# Altium schematic sheet CloudCover.SchDoc: Washing Hand Wrist Device
size A3; DrawnBy: Erwin Noble; Organization: Kickr Design; Address1: 1710 Chattahoochee Ave NW; Address2: Atlanta; Address3: GA; Address4: 30318; Revision: A; SheetNumber: 1; SheetTotal: 1
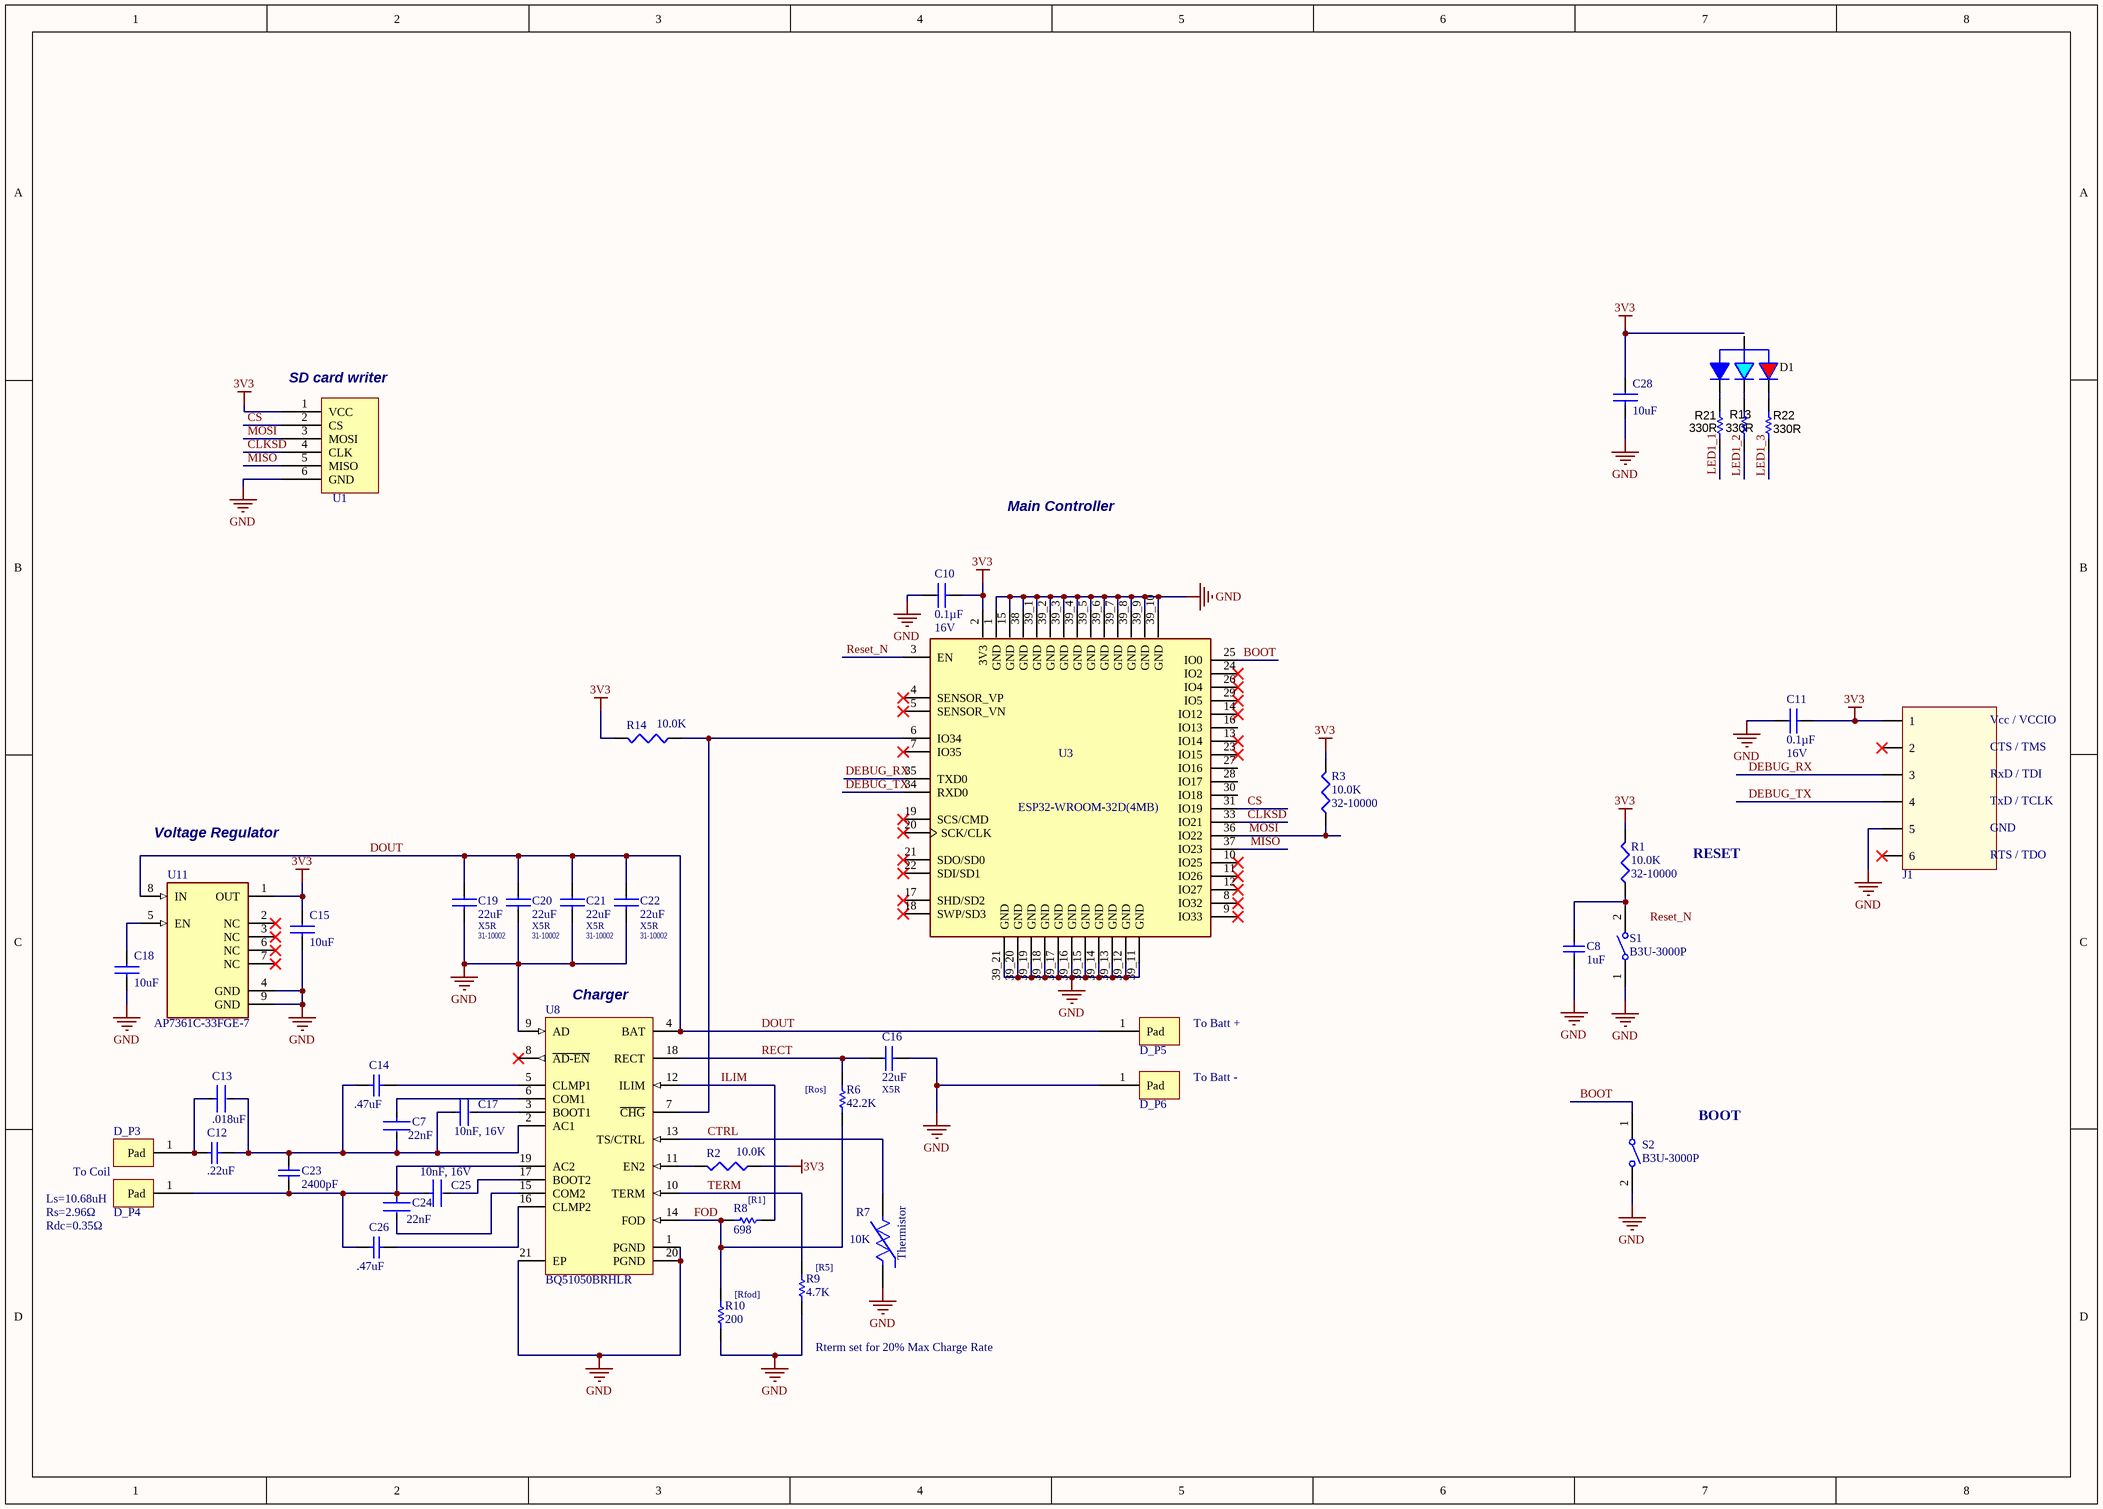
[diagram p0: CloudCover.SchDoc]

## Parts
C7  22nF  [FP-CC0402-MFG]
C8  1uF  [CAPC1005X55X25LL05T10]
C10  Capacitance: 0.1µF  Voltage - Rated: 16V  [SMC_IPC_0402]  (hidden comment: Cap, 0.1uF, 16V, X7R, 0402)
C11  Capacitance: 0.1µF  Voltage - Rated: 16V  [SMC_IPC_0402]  (hidden comment: Cap, 0.1uF, 16V, X7R, 0402)
C12  .22uF  [CAPC2013X145X50ML20T25]
C13  .018uF  [FP-C0603C-CF-MFG]
C14  .47uF  [CAPC1005X55X25LL05T10]
C15  10uF  [SMC_0603]
C16  22uF  Dielectric: X5R  [SMC_0805]
C17  10nF, 16V  [FP-CC0402-MFG]
C18  10uF  [SMC_0603]
C19  22uF  Dielectric: X5R  [SMC_0805]
C20  22uF  Dielectric: X5R  [SMC_0805]
C21  22uF  Dielectric: X5R  [SMC_0805]
C22  22uF  Dielectric: X5R  [SMC_0805]
C23  2400pF  [CAPC1608X90X35NL10T15]
C24  22nF  [FP-CC0402-MFG]
C25  10nF, 16V  [FP-CC0402-MFG]
C26  .47uF  [CAPC1005X55X25LL05T10]
C28  10uF  [SMC_0603]
D1  CLMVC-FKC-CGJJM569ABB7A343  [CLMVC-FKC-CGJJM569ABB7A343]  (value not drawn)
D_P3  PAD  [PAD 2x1.5]  (value not drawn)
D_P4  PAD  [PAD 2x1.5]  (value not drawn)
D_P5  PAD  [PAD 2x1.5]  (value not drawn)
D_P6  PAD  [PAD 2x1.5]  (value not drawn)
J1  TC2030-NL-FTDI TTL-232R USB  [TC2030-MCP - NL]  (value not drawn)  (no BOM)
R1  10.0K  [SMR_0402 - Basil]
R2  10.0K  [SMR_0402 - Basil]
R3  10.0K  [SMR_0402 - Basil]
R6  42.2K  [RESC1005X40X25NL05T10]
R7  10K  [FP-NTCS0805-MFG]
R8  698  [RESC1005X40X25ML05T05]
R9  4.7K  [RESC1005X40X25LL05T05]
R10  200  [RESC1005X40X25ML05T10]
R13  330R  [0402]
R14  10.0K  [SMR_0402 - Basil]
R21  330R  [0402]
R22  330R  [0402]
S1  B3U-3000P  [OMRON-B3U-3000P_V]
S2  B3U-3000P  [OMRON-B3U-3000P_V]
U1  SDCARDSLOT  (value not drawn)
U3  ESP32-WROOM-32D(4MB)  [MODULE_ESP32-WROOM-32D]
U8  BQ51050BRHLR  [RHL0020A_V]
U11  AP7361C-33FGE-7  [FP-U-DFN3030-8_Type_E-MFG]

## Nets
3V3: C10.2 C11.2 C15.1 C28.1 J1.1 R1.2 R2.1 R3.2 R14.2 U1.1(VCC) U3.2(3V3) U11.1(OUT)
GND: C8.1 C10.1 C11.1 C15.2 C16.2 C18.2 C19.2 C20.2 C21.2 C22.2 C28.2 D_P6.1(Pad) J1.5 R7.1 R9.1 R10.1 S1.1 S2.2 U1.6(GND) U3.1(GND) U3.15(GND) U3.38(GND) U3.39_1(GND) U3.39_2(GND) U3.39_3(GND) U3.39_4(GND) U3.39_5(GND) U3.39_6(GND) U3.39_7(GND) U3.39_8(GND) U3.39_9(GND) U3.39_10(GND) U3.39_11(GND) U3.39_12(GND) U3.39_13(GND) U3.39_14(GND) U3.39_15(GND) U3.39_16(GND) U3.39_17(GND) U3.39_18(GND) U3.39_19(GND) U3.39_20(GND) U3.39_21(GND) U8.1(PGND) U8.9(AD) U8.20(PGND) U8.21(EP) U11.4(GND) U11.9(GND)
BOOT: S2.1 U3.25(IO0)
CLKSD: U1.4(CLK) U3.33(IO21)
CS: U1.2(CS) U3.31(IO19)
CTRL: R7.2 U8.13(TS/CTRL)
DEBUG_RX: J1.3 U3.35(TXD0)
DEBUG_TX: J1.4 U3.34(RXD0)
DOUT: C19.1 C20.1 C21.1 C22.1 D_P5.1(Pad) U8.4(BAT) U11.8(IN)
FOD: R6.1 R8.1 R10.2 U8.14(FOD)
ILIM: R8.2 U8.12(ILIM)
LED1_1: R21.1
LED1_2: R13.1
LED1_3: R22.1
MISO: U1.5(MISO) U3.37(IO23)
MOSI: R3.1 U1.3(MOSI) U3.36(IO22)
RECT: C16.1 R6.2 U8.18(RECT)
Reset_N: U3.3(EN)
TERM: R9.2 U8.10(TERM)
NetC7_1: C7.1 U8.6(COM1)
NetC7_2: C7.2 C12.2 C13.2 C14.1 C17.1 C23.2 U8.2(AC1)
NetC8_2: C8.2 R1.1 S1.2
NetC12_1: C12.1 C13.1 D_P3.1(Pad)
NetC14_2: C14.2 U8.5(CLMP1)
NetC17_2: C17.2 U8.3(BOOT1)
NetC18_1: C18.1 U11.5(EN)
NetC23_1: C23.1 C24.1 C25.1 C26.1 D_P4.1(Pad) U8.19(AC2)
NetC24_2: C24.2 U8.15(COM2)
NetC25_2: C25.2 U8.17(BOOT2)
NetC26_2: C26.2 U8.16(CLMP2)
NetD1_2: D1.2(K) R21.2
NetD1_3: D1.3(K) R13.2
NetD1_4: D1.4(K) R22.2
NetR2_2: R2.2 U8.11(EN2)
NetR14_1: R14.1 U3.6(IO34) U8.7(~{CHG})

Not connected (* = marked no-connect by the designer): D1 1(A); J1 2* 6*; U3 4(SENSOR_VP)* 5(SENSOR_VN)* 7(IO35)* 8(IO32)* 9(IO33)* 10(IO25)* 11(IO26)* 12(IO27)* 13(IO14)* 14(IO12)* 16(IO13) 17(SHD/SD2)* 18(SWP/SD3)* 19(SCS/CMD)* 20(SCK/CLK)* 21(SDO/SD0)* 22(SDI/SD1)* 23(IO15)* 24(IO2)* 26(IO4)* 27(IO16) 28(IO17) 29(IO5)* 30(IO18); U8 8(~{AD-EN})*; U11 2(NC)* 3(NC)* 6(NC)* 7(NC)*

## Notes on the sheet
- (near U1) SD card writer
- Main Controller
- Voltage Regulator
- RESET
- (near U8) Charger
- To Batt +
- (near R6) [Ros]
- To Batt -
- BOOT
- To Coil
- Ls=10.68uH
- Rs=2.96Ω
- Rdc=0.35Ω
- (near R8) [R1]
- (near R7) Thermistor
- (near R10) [Rfod]
- (near R9) [R5]
- (near R9) Rterm set for 20% Max Charge Rate
- Labels drawn without touching a wire or pin: Reset_N
- Title
- Size:
- Date:
- A3
- Number:
- Time:
- Revision:
- Sheet
- of
- File:
- (in symbol TC2030-NL) Vcc / VCCIO; CTS / TMS; RxD / TDI; TxD / TCLK; GND; RTS / TDO

## Library data of the parts
C7 C24 = CMP-03422-000454-1: CC0402KPX7R7BB223 CC0402 22 nF X7R 10.00% 16 V; Manufacturer: YAGEO; Voltage Rating: 16 V; Automotive Grade: NA; Material: Ceramic; Tolerance: 0.1; Temperature Coefficient: 30ppm/°C; Automotive: No; Temperature Range Low: -55°C; Device Class L1: Passive Components; Height: 0.55mm; Temperature: -55°C to +125°C; Category: Cap; Capacitance: 22 nF; Device Class L3: Ceramic Capacitors; Lead Free: Yes; Ipc Land Pattern Name: CAPC10050X50; Package: CC0402; Device Class L2: Capacitors; Octopart: https://octopart.com/cc0402kpx7r7bb223-yageo-39266182; Temperature Characteristic: X7R; Footprint Url: http://www.yageo.com/exep/pages/download/literatures/UPY-C_GEN_24.pdf; Manufacturer Part Number: CC0402KPX7R7BB223; ComponentLink2Description: Datasheet; RoHS: TRUE; Value: 22 nF; Mouser Description: Multilayer Ceramic Capacitors MLCC - SMD/SMT 22nF 16V X7R 10%; ComponentLink2URL: http://www.yageo.com/documents/recent/UPY-GP_NP0_16V-to-50V_16.pdf; Temperature Range High: +125°C
C8 = CMP-2008-04506-1: GRM155C80J105KE15D; Manufacturer: Murata; Part Number: GRM155C80J105KE15D
C10 C11 = 31-10107: Capacitor, Ceramic, 0402, X7R, 16V, 0.1uF; Manufacturer: Murata Electronics North America; Manufacturer Part Number: GCM155R71C104KA55D; Tolerance: ±10%; Category: Capacitors; Mounting Type: Surface Mount; Operating Temperature: -55°C ~ 125°C; Applications: Automotive; Ratings: AEC-Q200; Package / Case: 0402; Thickness (Max): 0.022"; Kickr Part Number: 31-10107; Supplier: Digi-Key; Supplier Part Number - Cut Tape: 490-4759-1-ND; Supplier Part Number - T&R: 490-4759-2-ND
C12 = CMP-2007-01110-1: C0805C224J5RACTU; Manufacturer: Kemet; Part Number: C0805C224J5RACTU
C13 = CMP-03020-009056-1: C0603C183J5RAC7867 C0603 18,000 pF X7R 30ppm/°C 5.00% 50 V; Manufacturer: KEMET; Material: Ceramic; Automotive Grade: Grade 1; Voltage Rating: 50 V; Tolerance: 0.05; Capacitance: 18,000 pF; Height: 0.87mm; Device Class L3: Ceramic Capacitors; Value: 18,000 pF; Temperature Coefficient: 30ppm/°C; Lead Free: Yes; Device Class L2: Capacitors; Automotive: Yes; Temperature Range Low: -55°C; Package: C0603C-CF; Category: Cap; ComponentLink2Description: Datasheet; Device Class L1: Passive Components; Octopart: https://octopart.com/c0603c183j5rac7867-kemet-1732095; ComponentLink2URL: https://api.kemet.com/component-edge/download/datasheet/C0603C100J5GACAUTO.pdf; Temperature Characteristic: X7R; RoHS: TRUE; Temperature Range High: +125°C; Manufacturer Part Number: C0603C183J5RAC7867; Temperature: -55°C to +125°C
C14 C26 = CMP-2008-04548-1: GRM155R60J474KE19D .47uF 0402; Manufacturer: Murata; Part Number: GRM155R60J474KE19D
C15 C18 C28 = 31-10103: CAP CER 10UF 16V X6S 0603; Manufacturer: Murata Electronics North America; Manufacturer Part Number: GRM188C81C106MA73D; Voltage - Rated: 50V; Tolerance: ±10%; Temperature Coefficient: X7R; RoHS: RoHS Compliant; Category: Capacitors; Packaging: Cut Tape (CT); Capacitance: 10uF; Mounting Type: Surface Mount, MLCC; Operating Temperature: -55°C ~ 125°C; Applications: General Purpose; Ratings: -; Package / Case: 0603 (1608 Metric); Size / Dimension: 0.063" L x 0.032" W (1.60mm x 0.80mm); Height - Seated (Max): -; Thickness (Max): 0.035" (0.90mm); Lead Spacing: -; Features: -; Lead Style: -; Kickr Part Number: 31-10103; Supplier 1: Digi-Key; Supplier Part Number 1: 490-7198-2-ND
C16 C19-C22 = 31-10002: CAP CER 22UF 10V 20% X5R 0805; Manufacturer 1: Samsung; Manufacturer Part Number 1: CL21A226MPQNNNE; Manufacturer: TDK Corporation; Manufacturer Part Number: C2012X5R1A226M125AB; Comp Height (mm): 0.9; Capacitance: 22µF; ROHS: Y; Tolerance: 20%; Cost: 0.14950; ComponentLink1Description: Datasheet; ComponentLink1URL: http://www.tdk.com/pdf/TDKMLCCCapRange.pdf; Package: 0805; Voltage Rating: 10V; Supplier 1: Digi-Key; Supplier Part Number 1: 445-7665-6-ND; Category: Capacitors; Stock 1: 151477; Pricing 1: 1=0.52, 10=0.455, 100=0.2275, 250=0.182, 500=0.16576, 1000=0.1495 (USD); Packaging: Digi-Reel®; Voltage - Rated: 10V; Temperature Coefficient: X5R; Mounting Type: Surface Mount, MLCC; Operating Temperature: -55°C ~ 85°C; Applications: General Purpose; Ratings: -; Package / Case: 0805 (2012 Metric); Size / Dimension: 0.079" L x 0.049" W (2.00mm x 1.25mm); Height - Seated (Max): -; Thickness (Max): 0.057" (1.45mm); Lead Spacing: -; Features: -; Lead Style: -; ComponentLink2URL: http://product.tdk.com/en/catalog/datasheets/mlcc_commercial_general_en.pdf; ComponentLink2Description: http://product.tdk.com/en/catalog/datasheets/mlcc_commercial_general_en.pdf; Innovolt Part Number: 31-10002
C17 C25 = CMP-03422-000501-1: CC0402KRX7R7BB103 CAP CER 10000PF 16V X7R 0402; Manufacturer: YAGEO; Automotive Grade: NA; Material: Ceramic; Tolerance: 0.1; Temperature Coefficient: 30ppm/°C; Temperature Range Low: -55°C; Temperature Range High: +125°C; Mouser Description: 0402 10 nF 16 V ±10 % Tolerance X7R SMT Multilayer Ceramic Capacitor; Footprint Url: http://www.yageo.com/exep/pages/download/literatures/UPY-C_GEN_24.pdf; Category: Cap; RoHS: TRUE; Capacitance: 10 nF; Manufacturer Part Number: CC0402KRX7R7BB103; ComponentLink2Description: Datasheet; Ipc Land Pattern Name: CAPC10050X50; Value: 10 nF; Automotive: No; ComponentLink2URL: http://www.yageo.com/documents/recent/UPY-GP_NP0_16V-to-50V_16.pdf; Device Class L1: Passive Components; Height: 0.55mm; Temperature Characteristic: X7R; Package: CC0402; Voltage Rating: 16 V; Device Class L3: Ceramic Capacitors; Lead Free: Yes; Device Class L2: Capacitors; Digikey Description: CAP CER 10000PF 16V X7R 0402; Octopart: https://octopart.com/cc0402krx7r7bb103-yageo-192895; Temperature: -55°C to +125°C
C23 = CMP-2006-02639-1: GRM1885C1H242JA01D; Manufacturer: Murata; Part Number: GRM1885C1H242JA01D
D1 = CLMVC-FKC-CGJJM569ABB7A343: LED Multicolor Red/Green/Blue 624nm/540nm/470nm 25mA/13mA/13mA 4-Pin Surface Mount T/R; Manufacturer: Cree; Supplier 1: Mouser; Manufacturer Part Number: CLMVC-FKC-CGJJM569ABB7A343; Stock 1: 20354; Pricing 1: 1=0.18, 10=0.169, 50=0.168, 100=0.157, 1000=0.14, 10000=0.12, 38400=0.129 (USD); RoHS Compliant: Yes; Supplier Part Number 1: 941-CLMVG569ABB7A343
D_P3-D_P6 = PAD_1
J1 = TC2030-NL: Footprint TC2030-CTX Debug Connector; Innovolt Part Number: 40-10067; Manufacturer: Tag-Connect; Supplier 1: Tag-Connect; RoHS: RoHS Compliant; Category: Programmer Accessories; Stock 1: 0; Product: Debug Cables; Product Category: Evaluation Boards, Development Kits, Tools and Software; Standard Pack Qty: 1; RoHS - Mouser: Y; Minimum Order Quantity: 1; Reeling: False; Supplier Part Number 1: TC2030-CTX
R1-R3 R14 = 32-10000: RES 10.0K OHM 1/16W 1% 0402 SMD; Manufacturer Part Number: RC0402FR-0710KL; Manufacturer: Yageo; Comp Height (mm): 0.7; Resistance (Ohms): 10k; Power (Watts): 0.063W, 1/16W; Temperature Coefficient: ±100ppm/°C; Rule: PcbType=ProtelPcb; ROHS: Y; Cost: 0.00203; Digikey: 311-10.0KLRDKR-ND; Tolerance: ±1%; Power: 1/16W; ComponentLink1Description: Datasheet; ComponentLink1URL: http://www.yageo.com/documents/recent/PYu-RC0402_51_RoHS_L_6.pdf; Supplier 1: Digi-Key; Category: Resistors; Stock 1: 7229047; Pricing 1: 1=0.1, 10=0.015, 25=0.0108, 100=0.006, 250=0.00456, 500=0.00364, 1000=0.00268, 2500=0.00233, 5000=0.00192 (USD); Packaging: Cut Tape (CT); Composition: Thick Film; Features: -; Package / Case: 0402 (1005 Metric); Supplier Device Package: 0402; Size / Dimension: 0.039" L x 0.020" W (1.00mm x 0.50mm); Height: 0.016" (0.40mm); Number of Terminations: 2; Supplier Part Number 1: 311-10.0KLRCT-ND; Package: 0402; Innovolt Part Number: 32-10000
R6 = CMP-2002-07058-1: RC0402FR-0742K2L 42.2K, 1/16W, 0402; Manufacturer: Yageo / Phycomp; Part Number: RC0402FR-0742K2L
R7 = CMP-02404-000004-1: B57863S0103F040; Manufacturer: Vishay BC Components; Manufacturer Part Number: NTCS0805E3103JMT; Automotive Grade: Grade 0; Power Rating: 210mW; B Tolerance: 3%; Value: 10kΩ; B 25 85: 3570K; Tolerance: 5%; Automotive: Yes; Category: Res; Lead Free: Yes; Height: 0.95mm; RoHS: TRUE; Temperature Range Low: -40°C; Temperature: -40°C to +150°C; Device Class L2: Resistors; Digikey Description: THERMISTOR NTC 10KOHM 3570K 0805; ComponentLink2URL: http://www.vishay.com/docs/29044/ntcs0805e3t.pdf; Mouser Description: Thermistors - NTC 10K OHM 5%; Octopart: https://octopart.com/ntcs0805e3103jmt-vishay-39723061; Package: NTCS0805; Series: NTCS0805E; Resistance: 10kΩ; Device Class L1: Passive Components; Ipc Land Pattern Name: RESC200125X80; Device Class L3: Thermistors; ComponentLink2Description: Datasheet; Temperature Range High: +150°C
R8 = CMP-2002-00177-1: CRCW0402698RFKED 698 ohm, 1/16W, 0402; Manufacturer: Vishay Dale; Part Number: CRCW0402698RFKED
R9 = CMP-1665-00031-3: ERJ-2RKF4 701XChip Resistor, 4.7 KOhm, +/- 1%, 0.1 W, -55 to 155 degC, 0402 (1005 Metric), RoHS, Tape and Reel; Voltage Rating: 50 V; Case\/Package: 0402; Power Rating: 100 mW; Height: 0.35 mm; Mounting Technology: Surface Mount; REACH SVHC: Yes; Resistance: 4.7 KOhm; Max Operating Temperature: 155 degC; ComponentLink1Description: Manufacturer URL; ComponentLink2Description: Datasheet; Pins: 2; PackageReference: 0402; Tolerance: 1%; Case Code (Imperial): 0402; Length: 1 mm; PackageDescription: 2-Pin Surface Mount Device, Body 1 x 0.5 mm; PartNumber: ERJ-2RKF4701X; RoHSCompliant: true; Package Quantity: 1; Radiation Hardening: No; DatasheetVersion: 04/2015; Width: 0.5 mm; Case Code (Metric): 1005; Mount: Surface Mount; ComponentLink1URL: http://www.panasonic.com/; Min Operating Temperature: -55 degC; Packaging: Cut Tape; ComponentLink2URL: http://industrial.panasonic.com/cdbs/www-data/pdf/RDA0000/AOA0000C86.pdf
R10 = CMP-2002-07498-1: RC0402FR-07200RL 200 ohm, 1/16W, 0402; Manufacturer: Yageo / Phycomp; Part Number: RC0402FR-07200RL
R13 R21 R22 = CRCW0402330RFKED: Res Thick Film 0402 330 Ohm 1% 1/16W ±100ppm/°C Molded SMD Paper T/R; Manufacturer: Vishay; Power Rating: 63mW; Voltage Rating: 50V; Supplier 1: Digi-Key; Manufacturer Part Number: CRCW0402330RFKED; Stock 1: 340589; Pricing 1: 1=0.1, 10=0.038, 100=0.0153, 1000=0.0069, 2500=0.006, 5000=0.0049 (USD); Case/Package: 0402; Case Code (Imperial): 0402; Case Code (Metric): 1005; Weight: 2.3E-05oz; Size Code: 0402; Contact Plating: Tin; Min Operating Temperature: -55°C; Max Operating Temperature: 155°C; Resistor Type: Thick Film; Resistance: 330R; Tolerance: 1%; Temperature Coefficient: 100ppm/°C; Resistance Tolerance: 1%; Packaging: Tape and Reel; Series: CRCW; Package Quantity: 10; Number of Terminations: 2; Termination: SMD/SMT; Max Power Dissipation: 63mW; Voltage Rating (DC): 50V; Construction: Rectangular; Features: Automotive AEC-Q200; Technology: THICK FILM; Length: 1mm; Width: 0.5mm; Height: 0.35mm; Depth: 0.5mm; Radiation Hardening: No; REACH SVHC: Unknown; RoHS Compliant: Yes; Military Standard: Not; Lead Free: Lead Free; ComponentLink1URL: http://www.farnell.com/datasheets/2310790.pdf?src-supplier=Element14; ComponentLink1Description: http://www.farnell.com/datasheets/2310790.pdf?src-supplier=Element14; ComponentLink2URL: http://www.vishay.com/docs/20035/dcrcwe3.pdf?src-supplier=Digi-Key; ComponentLink2Description: http://www.vishay.com/docs/20035/dcrcwe3.pdf?src-supplier=Digi-Key; ComponentLink3URL: http://uk.rs-online.com/webdocs/0d98/0900766b80d98824.pdf?src-supplier=RSComponents; ComponentLink3Description: http://uk.rs-online.com/webdocs/0d98/0900766b80d98824.pdf?src-supplier=RSComponents; ComponentLink4URL: https://www.alliedelec.com/m/d/0c934d6939ccefa68dbe0b96d821c8cf.pdf?src-supplier=Allied+Electronics; ComponentLink4Description: https://www.alliedelec.com/m/d/0c934d6939ccefa68dbe0b96d821c8cf.pdf?src-supplier=Allied+Electronics; ComponentLink5URL: http://www.mouser.com/ds/2/427/dcrcwe3-109170.pdf?src-supplier=Mouser; ComponentLink5Description: http://www.mouser.com/ds/2/427/dcrcwe3-109170.pdf?src-supplier=Mouser; ComponentLink6URL: http://www.vishay.com/docs/20035/dcrcwe3.pdf?src-supplier=Future+Electronics; ComponentLink6Description: http://www.vishay.com/docs/20035/dcrcwe3.pdf?src-supplier=Future+Electronics; ComponentLink7URL: http://www.vishay.com/docs/20035/dcrcwe3.pdf?src-supplier=Avnet+Europe; ComponentLink7Description: http://www.vishay.com/docs/20035/dcrcwe3.pdf?src-supplier=Avnet+Europe; ComponentLink8URL: http://www.vishay.com/docs/20035/dcrcwe3.pdf?src-supplier=Avnet; ComponentLink8Description: http://www.vishay.com/docs/20035/dcrcwe3.pdf?src-supplier=Avnet; Supplier Part Number 1: 541-330LCT-ND
S1 S2 = CMP-1677-00003-1: Ultra-Small Tactile Switch, 1 to 50 mA, 3 to 12 V, -25 to 70 degC, 2-Pin SMD, RoHS, Tape and Reel; Tolerance: 20%; Voltage Rating (DC): 50 V; Capacitance: 470 uF; Case\Package: Radial; PackageReference: B3U-3000P; Min Operating Temperature: -40 degC; Length: 20 mm; Mount: Through Hole; ComponentLink2Description: Datasheet; RoHSCompliant: true; ComponentLink1URL: http://www.omron.com/; Package Quantity: 200; Radiation Hardening: No; Height: 20 mm; ComponentLink2URL: https://www.omron.com/ecb/products/pdf/en-b3u.pdf; Diameter: 10 mm; Max Operating Temperature: 85 degC; Lead Pitch: 5 mm; DatasheetVersion: Jan-15; Packaging: Bulk; PackageDescription: 2-Pin Surface Mount Device, Body 4 x 3.2 mm; Voltage Rating: 50 V; Pins: 2; ComponentLink1Description: Manufacturer URL; REACH SVHC: No SVHC
U3 = ESP32-WROOM-32D(4MB): Bluetooth and Wi-Fi Module 2.4GHz to 2.5GHz 2.7V to 3.6V 4MB Flash 38-Pin SMD Module; Manufacturer: Espressif Systems; Supplier 1: Digi-Key; Manufacturer Part Number: ESP32-WROOM-32D(4MB); Stock 1: 17944; Pricing 1: 1=3.8 (USD); Supplier Part Number 1: 1965-ESP32-WROOM-32D(4MB)CT-ND
U8 = CMP-0393-00008-2: Qi (WPC) Compliant Highly Integrated Secondary-Side Direct Lithium Ion Charger, 4 V Min Input, 20-pin VQFN (RHL), Green (RoHS & no Sb/Br); Charge Current(Max)(A): 1.5; Eco-Plan: TRUE; Vin(Min)(V): 4; Mounting Technology: Surface Mount; PartNumber: BQ51050BRHLR; PackageDescription: 20-Pin Plastic Flat Pack, Body 4.5 x 3.5 mm, Pitch 0.5 mm; PackageVersion: 4205346-3/J, 12/2011; ComponentLink3Description: Package Specification; PackageReference: RHL0020A; ComponentLink2Description: Datasheet; ComponentLink3URL: http://www.ti.com/lit/ds/symlink/bq51051b.pdf; DatasheetVersion: SLUSB42D; ComponentLink1Description: Manufacturer URL; ComponentLink2URL: http://www.ti.com/lit/ds/symlink/bq51050b.pdf; ComponentLink1URL: http://www.ti.com/
U11 = CMP-12756-000002-1: IC REG LINEAR 3.3V 1A UDFN3030-8; Manufacturer: Diodes Inc.; Standoff Height: 0mm; Nominal Supply Current: 60uA; Number Of Outputs: 1; Max Junction Temp: +150°C; Output Type: Fixed; Dropout Voltage: 840mV; Min Supply Voltage: 2.2V; Max Power Dissipation: 1700mW; Accuracy Percentage: 1%; Max Supply Voltage: 6V; Ipc Land Pattern Name: DFN300X300X60-8; Footprint Url: https://www.diodes.com/assets/Package-Files/U-DFN3030-8-Type-E.pdf; Output Voltage: 3.3V; Manufacturer Part Number: AP7361C-33FGE-7; Device Class L3: Voltage Regulators - Linear; Temperature: -40°C to +150°C; Temperature Range High: +150°C; Mouser Description: LDO Voltage Regulators 1A LDO Reg w/Enable 3.3V 6.5Vin 1700mW; Height: 0.63mm; Ambient Temperature Range High: +85°C; ComponentLink2Description: Datasheet; Automotive: No; Output Current: 1A; Octopart: https://octopart.com/ap7361c-33fge-7-diodes+inc.-65869522; Package: U-DFN3030-8 (Type E); Digikey Description: IC REG LINEAR 3.3V 1A UDFN3030-8; Lead Free: Yes; Category: IC; Device Class L1: Integrated Circuits (ICs); Ambient Temperature Range Low: -40°C; Device Class L2: Power Management ICs; RoHS: TRUE; Temperature Range Low: -40°C; ComponentLink2URL: https://www.diodes.com/assets/Datasheets/AP7361C.pdf